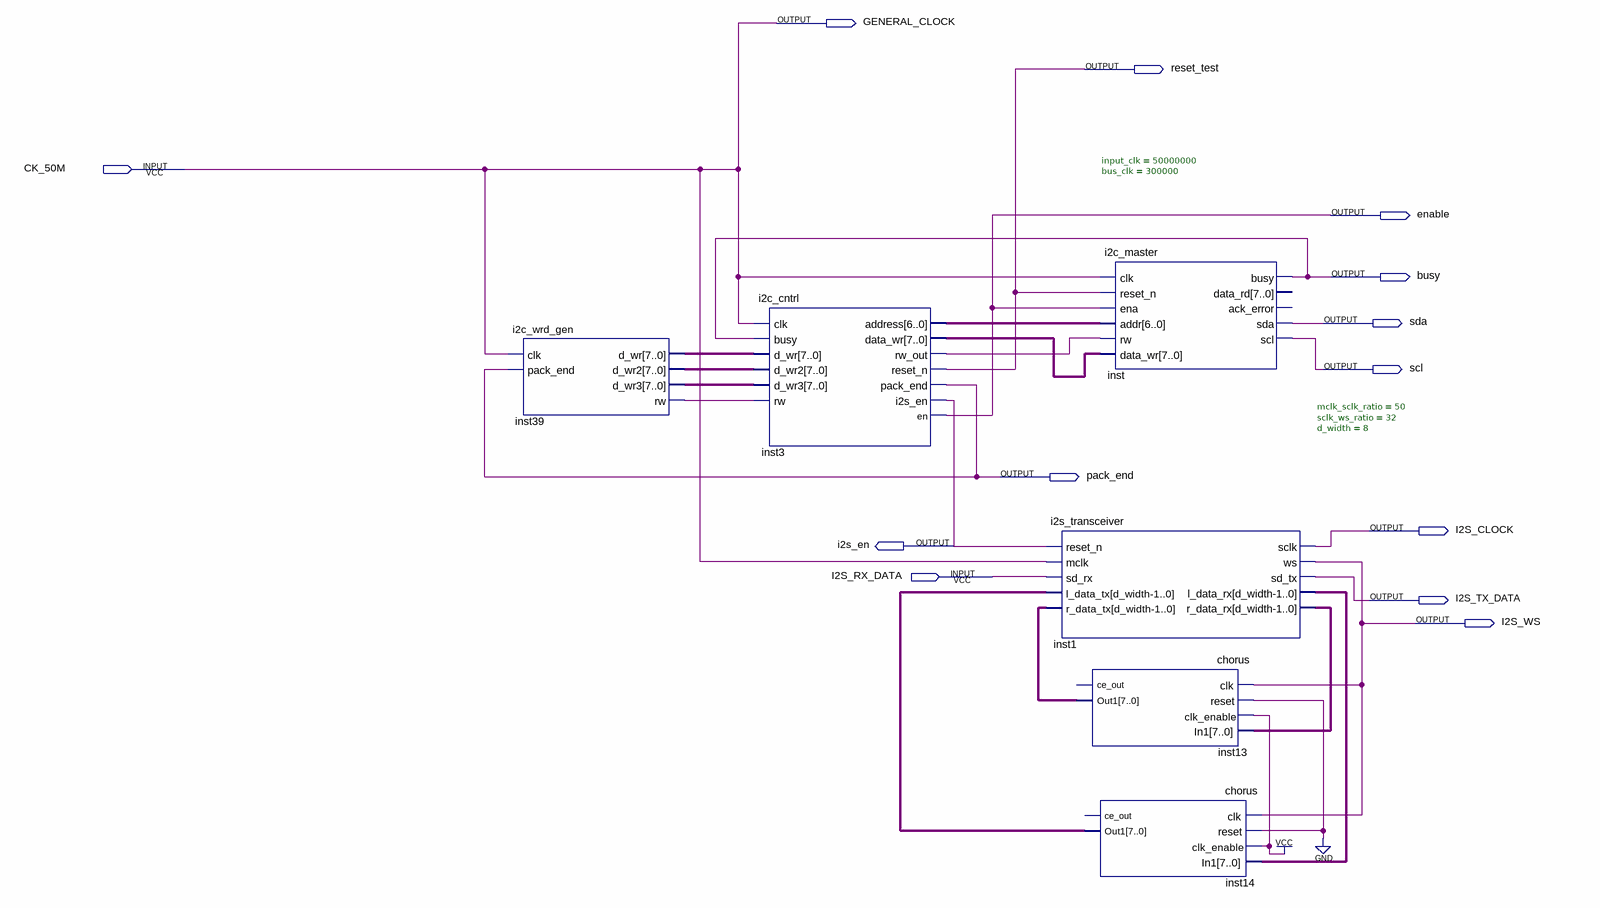
[diagram p0: schematic sheet]
// Quartus schematic TP_FINAL.bdf as structural Verilog: 6 symbols, 13 pins
module TP_FINAL (
  input  CK_50M,
  input  I2S_RX_DATA,
  output GENERAL_CLOCK,
  output reset_test,
  output enable,
  output busy,
  output sda,
  output scl,
  output pack_end,
  output I2S_CLOCK,
  output i2s_en,
  output I2S_TX_DATA,
  output I2S_WS
);

  wire inst3_rw_out, inst39_rw;
  wire [6:0] inst3_address;
  wire [7:0] inst1_l_data_rx, inst1_r_data_rx, inst3_data_wr, inst13_out1, inst14_out1, inst39_d_wr,
       inst39_d_wr2, inst39_d_wr3;

  i2c_wrd_gen inst39 (
    .clk(CK_50M), .pack_end(pack_end), .d_wr(inst39_d_wr), .d_wr2(inst39_d_wr2), .d_wr3(inst39_d_wr3),
    .rw(inst39_rw));
  i2c_cntrl inst3 (
    .clk(CK_50M), .busy(busy), .d_wr(inst39_d_wr), .d_wr2(inst39_d_wr2), .d_wr3(inst39_d_wr3),
    .rw(inst39_rw), .address(inst3_address), .data_wr(inst3_data_wr), .rw_out(inst3_rw_out),
    .reset_n(reset_test), .pack_end(pack_end), .i2s_en(i2s_en), .en(enable));
  i2s_transceiver #(.mclk_sclk_ratio(50), .sclk_ws_ratio(32), .d_width(8)) inst1 (
    .reset_n(i2s_en), .mclk(CK_50M), .sd_rx(I2S_RX_DATA), .l_data_tx(inst14_out1), .r_data_tx(inst13_out1),
    .sclk(I2S_CLOCK), .ws(I2S_WS), .sd_tx(I2S_TX_DATA), .l_data_rx(inst1_l_data_rx),
    .r_data_rx(inst1_r_data_rx));
  i2c_master #(.input_clk(50000000), .bus_clk(300000)) inst (
    .clk(CK_50M), .reset_n(reset_test), .ena(enable), .addr(inst3_address), .rw(inst3_rw_out),
    .data_wr(inst3_data_wr), .busy(busy), .sda(sda), .scl(scl));  // open: data_rd, ack_error
  chorus inst13 (
    .clk(I2S_WS), .reset(1'b0), .clk_enable(1'b1), .In1(inst1_r_data_rx), .Out1(inst13_out1));  // open: ce_out
  chorus inst14 (
    .clk(I2S_WS), .reset(1'b0), .clk_enable(1'b1), .In1(inst1_l_data_rx), .Out1(inst14_out1));  // open: ce_out

  assign GENERAL_CLOCK = CK_50M;
endmodule
